# Altium schematic sheet Microcontroller_Main.SchDoc
size A4; DocumentNumber: 1; SheetNumber: 3; SheetTotal: 3
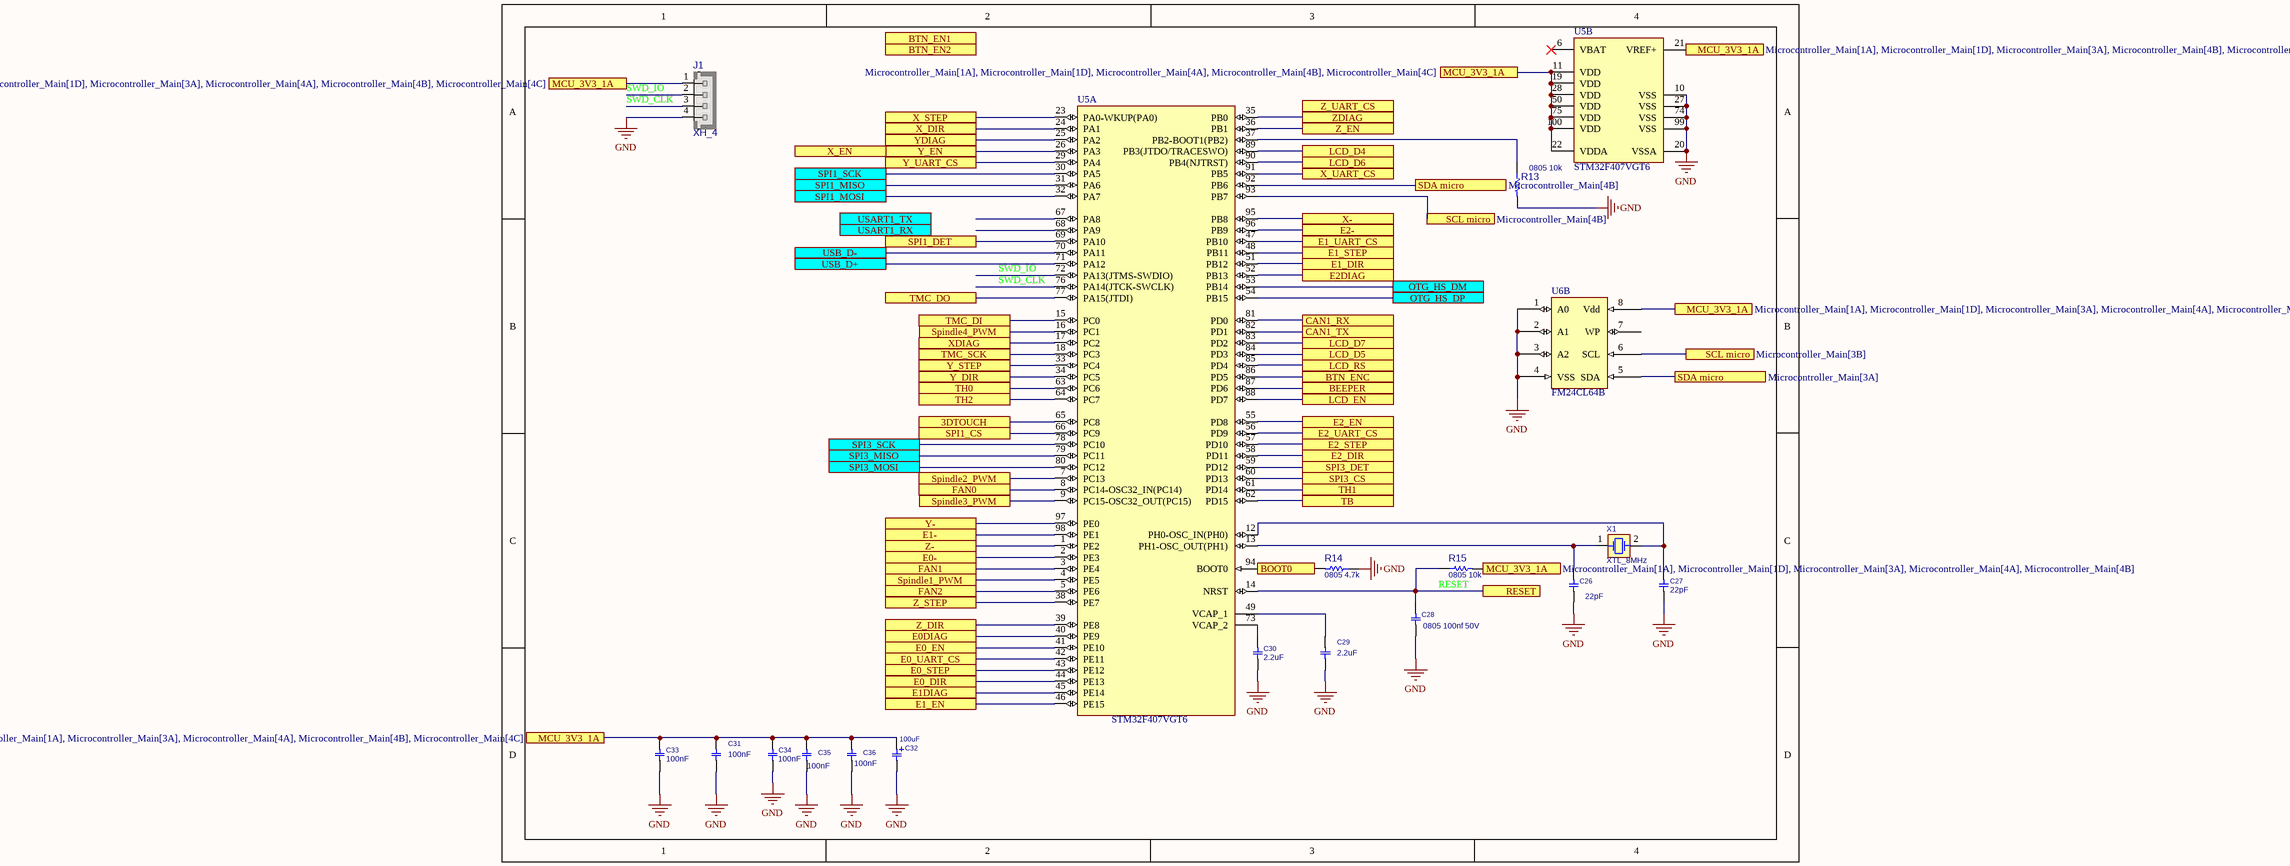
[diagram p0: Microcontroller_Main.SchDoc]

## Parts
C26  22pF  [C0603]
C27  22pF  [C0603]
C28  0805 100nf 50V  [C0805]
C29  2.2uF  [C0603]
C30  2.2uF  [C0603]
C31  100nF  [C0603]
C32  100uF  [C_TN_7343]
C33  100nF  [C0603]
C34  100nF  [C0603]
C35  100nF  [C0603]
C36  100nF  [C0603]
J1  XH_4  [XH_4]
R13  0805 10k  [R0805]
R14  0805 4.7k  [R0805]
R15  0805 10k  [R0805]
U5  STM32F407VGT6  [STM-LQFP100_N]  (parts A,B of 2)
U6  FM24CL64B  [SOP8]  (part B of 2)
X1  XTL_8MHz  [XTL_2_11X5]

## Ports
3DTOUCH, BEEPER, BOOT0, BTN_EN1, BTN_EN2, BTN_ENC, CAN1_RX, CAN1_TX, E0-, E0_DIR, E0_EN, E0_STEP, E0_UART_CS, E0DIAG, E1-, E1_DIR, E1_EN, E1_STEP, E1_UART_CS, E1DIAG, E2-, E2_DIR, E2_EN, E2_STEP, E2_UART_CS, E2DIAG, FAN0, FAN1, FAN2, LCD_D4, LCD_D5, LCD_D6, LCD_D7, LCD_EN, LCD_RS, MCU_3V3_1A (see Microcontroller_Main[1A], Microcontroller_Main[1D], Microcontroller_Main[3A], Microcontroller_Main[4A], Microcontroller_Main[4B]), MCU_3V3_1A (see Microcontroller_Main[1A], Microcontroller_Main[1D], Microcontroller_Main[3A], Microcontroller_Main[4A], Microcontroller_Main[4C]), MCU_3V3_1A (see Microcontroller_Main[1A], Microcontroller_Main[1D], Microcontroller_Main[3A], Microcontroller_Main[4B], Microcontroller_Main[4C]), MCU_3V3_1A (see Microcontroller_Main[1A], Microcontroller_Main[1D], Microcontroller_Main[4A], Microcontroller_Main[4B], Microcontroller_Main[4C]), MCU_3V3_1A (see Microcontroller_Main[1A], Microcontroller_Main[3A], Microcontroller_Main[4A], Microcontroller_Main[4B], Microcontroller_Main[4C]), MCU_3V3_1A (see Microcontroller_Main[1D], Microcontroller_Main[3A], Microcontroller_Main[4A], Microcontroller_Main[4B], Microcontroller_Main[4C]), OTG_HS_DM, OTG_HS_DP, RESET, SCL micro (see Microcontroller_Main[3B]), SCL micro (see Microcontroller_Main[4B]), SDA micro (see Microcontroller_Main[3A]), SDA micro (see Microcontroller_Main[4B]), SPI1_CS, SPI1_DET, SPI1_MISO, SPI1_MOSI, SPI1_SCK, SPI3_CS, SPI3_DET, SPI3_MISO, SPI3_MOSI, SPI3_SCK, Spindle1_PWM, Spindle2_PWM, Spindle3_PWM, Spindle4_PWM, TB, TH0, TH1, TH2, TMC_DI, TMC_DO, TMC_SCK, USART1_RX, USART1_TX, USB_D+, USB_D-, X-, X_DIR, X_EN, X_STEP, X_UART_CS, XDIAG, Y-, Y_DIR, Y_EN, Y_STEP, Y_UART_CS, YDIAG, Z-, Z_DIR, Z_EN, Z_STEP, Z_UART_CS, ZDIAG

## Nets
GND: C26.1 C27.1 C28.1 C29.1 C30.1 C31.1 C32.2 C33.1 C34.1 C35.1 C36.1 J1.4 R13.2 R14.1 U5.10(VSS) U5.20(VSSA) U5.27(VSS) U5.74(VSS) U5.99(VSS) U6.1(A0) U6.2(A1) U6.3(A2) U6.4(VSS)
3DTOUCH: U5.65(PC8) ; port 3DTOUCH
BEEPER: U5.87(PD6) ; port BEEPER
BOOT0: R14.2 U5.94(BOOT0) ; port BOOT0
BTN_ENC: U5.86(PD5) ; port BTN_ENC
CAN1_RX: U5.81(PD0) ; port CAN1_RX
CAN1_TX: U5.82(PD1) ; port CAN1_TX
E0-: U5.2(PE3) ; port E0-
E0_DIR: U5.44(PE13) ; port E0_DIR
E0_EN: U5.41(PE10) ; port E0_EN
E0_STEP: U5.43(PE12) ; port E0_STEP
E0_UART_CS: U5.42(PE11) ; port E0_UART_CS
E0DIAG: U5.40(PE9) ; port E0DIAG
E1-: U5.98(PE1) ; port E1-
E1_DIR: U5.51(PB12) ; port E1_DIR
E1_EN: U5.46(PE15) ; port E1_EN
E1_STEP: U5.48(PB11) ; port E1_STEP
E1_UART_CS: U5.47(PB10) ; port E1_UART_CS
E1DIAG: U5.45(PE14) ; port E1DIAG
E2-: U5.96(PB9) ; port E2-
E2_DIR: U5.58(PD11) ; port E2_DIR
E2_EN: U5.55(PD8) ; port E2_EN
E2_STEP: U5.57(PD10) ; port E2_STEP
E2_UART_CS: U5.56(PD9) ; port E2_UART_CS
E2DIAG: U5.52(PB13) ; port E2DIAG
FAN0: U5.8(PC14-OSC32_IN(PC14)) ; port FAN0
FAN1: U5.3(PE4) ; port FAN1
FAN2: U5.5(PE6) ; port FAN2
LCD_D4: U5.89(PB3(JTDO/TRACESWO)) ; port LCD_D4
LCD_D5: U5.84(PD3) ; port LCD_D5
LCD_D6: U5.90(PB4(NJTRST)) ; port LCD_D6
LCD_D7: U5.83(PD2) ; port LCD_D7
LCD_EN: U5.88(PD7) ; port LCD_EN
LCD_RS: U5.85(PD4) ; port LCD_RS
MCU_3V3_1A: C31.2 C32.1 C33.2 C34.2 C35.2 C36.2 J1.1 R15.2 U5.11(VDD) U5.19(VDD) U5.21(VREF+) U5.22(VDDA) U5.28(VDD) U5.50(VDD) U5.75(VDD) U5.100(VDD) U6.8(Vdd) ; port MCU_3V3_1A
OTG_HS_DM: U5.53(PB14) ; port OTG_HS_DM
OTG_HS_DP: U5.54(PB15) ; port OTG_HS_DP
RESET: C28.2 R15.1 U5.14(NRST) ; port RESET
SCL micro: U5.93(PB7) U6.6(SCL) ; port SCL micro
SDA micro: U5.92(PB6) U6.5(SDA) ; port SDA micro
SPI1_CS: U5.66(PC9) ; port SPI1_CS
SPI1_DET: U5.69(PA10) ; port SPI1_DET
SPI1_MISO: U5.31(PA6) ; port SPI1_MISO
SPI1_MOSI: U5.32(PA7) ; port SPI1_MOSI
SPI1_SCK: U5.30(PA5) ; port SPI1_SCK
SPI3_CS: U5.60(PD13) ; port SPI3_CS
SPI3_DET: U5.59(PD12) ; port SPI3_DET
SPI3_MISO: U5.79(PC11) ; port SPI3_MISO
SPI3_MOSI: U5.80(PC12) ; port SPI3_MOSI
SPI3_SCK: U5.78(PC10) ; port SPI3_SCK
Spindle1_PWM: U5.4(PE5) ; port Spindle1_PWM
Spindle2_PWM: U5.7(PC13) ; port Spindle2_PWM
Spindle3_PWM: U5.9(PC15-OSC32_OUT(PC15)) ; port Spindle3_PWM
Spindle4_PWM: U5.16(PC1) ; port Spindle4_PWM
SWD_CLK: J1.3 U5.76(PA14(JTCK-SWCLK))
SWD_IO: J1.2 U5.72(PA13(JTMS-SWDIO))
TB: U5.62(PD15) ; port TB
TH0: U5.63(PC6) ; port TH0
TH1: U5.61(PD14) ; port TH1
TH2: U5.64(PC7) ; port TH2
TMC_DI: U5.15(PC0) ; port TMC_DI
TMC_DO: U5.77(PA15(JTDI)) ; port TMC_DO
TMC_SCK: U5.18(PC3) ; port TMC_SCK
USB_D+: U5.71(PA12) ; port USB_D+
USB_D-: U5.70(PA11) ; port USB_D-
X-: U5.95(PB8) ; port X-
X_DIR: U5.24(PA1) ; port X_DIR
X_EN: U5.26(PA3) ; port Y_EN, port X_EN
X_STEP: U5.23(PA0-WKUP(PA0)) ; port X_STEP
X_UART_CS: U5.91(PB5) ; port X_UART_CS
XDIAG: U5.17(PC2) ; port XDIAG
Y-: U5.97(PE0) ; port Y-
Y_DIR: U5.34(PC5) ; port Y_DIR
Y_STEP: U5.33(PC4) ; port Y_STEP
Y_UART_CS: U5.29(PA4) ; port Y_UART_CS
YDIAG: U5.25(PA2) ; port YDIAG
Z-: U5.1(PE2) ; port Z-
Z_DIR: U5.39(PE8) ; port Z_DIR
Z_EN: U5.36(PB1) ; port Z_EN
Z_STEP: U5.38(PE7) ; port Z_STEP
ZDIAG: U5.35(PB0) ; port ZDIAG
NetC26_2: C26.2 U5.13(PH1-OSC_OUT(PH1)) X1.1(OSC1)
NetC27_2: C27.2 U5.12(PH0-OSC_IN(PH0)) X1.2(OSC2)
NetC29_2: C29.2 U5.49(VCAP_1)
NetC30_2: C30.2 U5.73(VCAP_2)
NetR13_1: R13.1 U5.37(PB2-BOOT1(PB2))

Not connected (* = marked no-connect by the designer): U5 6(VBAT)* 67(PA8) 68(PA9); U6 7(WP)

## Library data of the parts
C26 C27 C29-C31 C33-C36 = CAP_SMD_MLCC_0603: CAP, MLCC; PARAM: -, -%; MANF_P#: MANF_PART#; PARAM2: -V; PRICE: 100= 1$; MANF: -; ASSEMBLY: ASSEMBLY
  C26 C27: VALUE: 22pF
  C29 C30: VALUE: 2.2uF
  C33: VALUE: 100nF
C28 = CAP_SMD_MLCC_0805: C2012X5R1H106K125AC; PARAM: -, -%; MANF_P#: MANF_PART#; PARAM2: -V; PRICE: 100= 1$; MANF: -; ASSEMBLY: ASSEMBLY
C32 = CAP_SMD_TAN_100uF_16V: CAP, SMD, TAN; PARAM: 20%, 50mOhm, -55~105oC; MANF: AVX; MANF_P#: TCJD107M016R0050; PARAM2: 16V; PRICE: 1.9$; VALUE: 100uF
J1 = XH_4: PW10-x-M, JST-BxB-XH-A pitch: 2.5mm, 3A/250v; MANF: JST; MANF_P#: B4B-XH-A; PARAM2: 250v; PARAM: 3.0A; VALUE: XH_4
R13-R15 = RES_SMD_0805: RESISTOR, SMD; PARAM: -W; DESC: DESCRIPTION; DIST#: MOUSER; PARAM2: 1%; VALUE: 0805 10 ohm; MANF_P#: -; MANF: -; ASSEMBLY: ASSEMBLY; PRICE: 100= 0.5$
U5 = STM32F407VGT6: ARM Cortex-M4 32-bit MCU+FPU, 210 DMIPS, 1024 kB Flash, 192 kB Internal RAM, 82 I/Os, 100-pin LQFP, -40 to 85 degC, Tray; Manufacturer: STMicroelectronics; D/A Converter: 2x12-bit; FLASH Size (Prog) (kB): 1024; I/Os (High Current): 82; Internal RAM Size (kB): 192; Operating Frequency(F) (Processor speed) (MHz): 168; Supply Voltage(Vcc) max (V): 3.6; Supply Voltage(Vcc) min (V): 1.8; DatasheetVersion: Rev. 4; PackageVersion: Rev. 1, 06/2013; PackageReference: LQFP100; PackageDescription: 100-Pin Low Profile Quad Flat Package, 14 x 14 mm Body, 0.5 mm Pitch; Supplier 1: Digi-Key; Supplier Part Number 1: 497-11605-ND; Supplier 2: Farnell; Supplier Part Number 2: 2064368; Supplier 3: Newark; Supplier Part Number 3: 73T2333; Supplier 4: Mouser; Supplier Part Number 4: 511-STM32F407VGT6; Core: ARM Cortex-M4; Packing: Tray; Mounting Technology: Surface Mount; PartNumber: STM32F407VGT6; ComponentLink1Description: Manufacturer URL; ComponentLink1URL: http://www.st.com/web/en/home.html; ComponentLink2Description: Datasheet; ComponentLink2URL: http://www.st.com/st-web-ui/static/active/en/resource/technical/document/datasheet/DM00037051.pdf; ComponentLink3Description: Package Specification; ComponentLink3URL: http://www.st.com/st-web-ui/static/active/en/resource/technical/document/data_brief/DM00071938.pdf
X1 = XTL_2_HC49_8MHz_SMD: Crystal MOST POPULAR ABL HC49 PACKAGE; MANF: ABRACON; MANF_P#: ABLS-8.000MHZ-B4-T; PARAM: 8MHz, 18pF, 30PPM, -20~70oC; PRICE: 0.3$; VALUE: XTL_8MHz